# Altium schematic sheet 1.2V_regulator.SchDoc: 1.2V FPGA power supply
size A4; Author: L. Sartory; Organization: L. Sartory; Address2: Nixie clock; Address3: with GPS synchronization; DocumentNumber: 10; Revision: A1; SheetNumber: 10; SheetTotal: 14
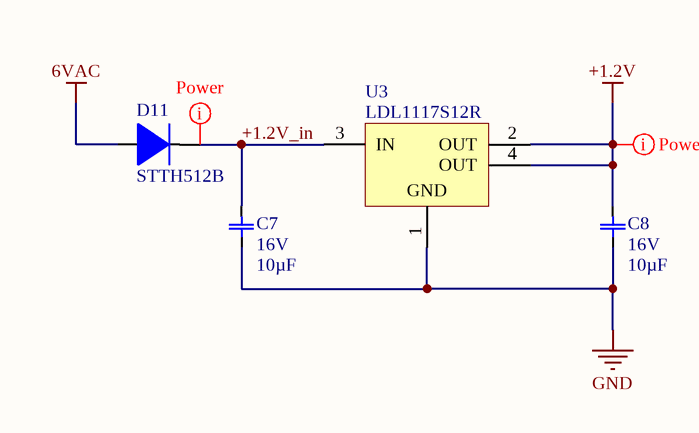
[diagram p0: 1.2V_regulator.SchDoc]

## Parts
C7  Voltage: 16V  [MLCC_1210]  (hidden comment: 10µF)
C8  Voltage: 16V  [MLCC_1210]  (hidden comment: 10µF)
D11  STTH512B  [STTH512B]
U3  LDL1117S12R  [TLV1117]

## Nets
6VAC: D11.A
+1.2V: C8.2 U3.2(OUT) U3.4(OUT)
GND: C7.1 C8.1 U3.1(GND)
+1.2V_in: C7.2 D11.K U3.3(IN)

## Layout directives
net class Power: +1.2V, +1.2V_in

## Notes on the sheet
- Title
- Size:
- Date:
- A4
- Number:
- Time:
- Revision:
- Sheet
- of
- File:

## Library data of the parts
C7 C8 = MLCC 10µF 16V 1210: Value: 10µF
D11 = STTH512B: Ultrafast recovery - 1200 V diode; HelpURL: https://datasheet.ciiva.com/6374/cd00096465-6374991.pdf
U3 = LDL1117S12R: Fixed LDO Voltage Regulator, 2.6 V to 18 V input, 170 mV Dropout, 1.2 V / 1.2 A out, SOT-223-4; Manufacturer: Texas Instruments; PartNumber: TLV1117LV30DCYT; Vout Adj(Min)(V): 3; Iout(Max)(A): 1; Vin(Max)(V): 5.5; Vdo(Typ)(mV): 1200; Accuracy(%): 2; SubFamily: Single Channel LDO; Iq(Typ)(mA): 0.05; Eco-Plan: Green (RoHS & no Sb/Br); PackageVersion: 4202506/B; ComponentLink2URL: http://www.ti.com/general/docs/lit/getliterature.tsp?genericPartNumber=TLV1117LV30&fileType=pdf; ComponentLink3URL: http://www.ti.com/litv/pdf/mpds094a; ComponentLink3Description: Package Specification; Mounting Technology: Surface Mount; PackageDescription: 4-Pin Plastic Small Outline, Body 3.5 x 6.5 mm, Pitch 2.3 mm; DatasheetVersion: SBVS160A; Fixed Output Options(V): 3; Vin(Min)(V): 2; PackageReference: DCY0004A; Code_JEDEC: TO-261; ComponentLink2Description: Datasheet; ComponentLink1Description: Manufacturer URL; ComponentLink1URL: http://www.ti.com/; Vout Adj(Max)(V): 3